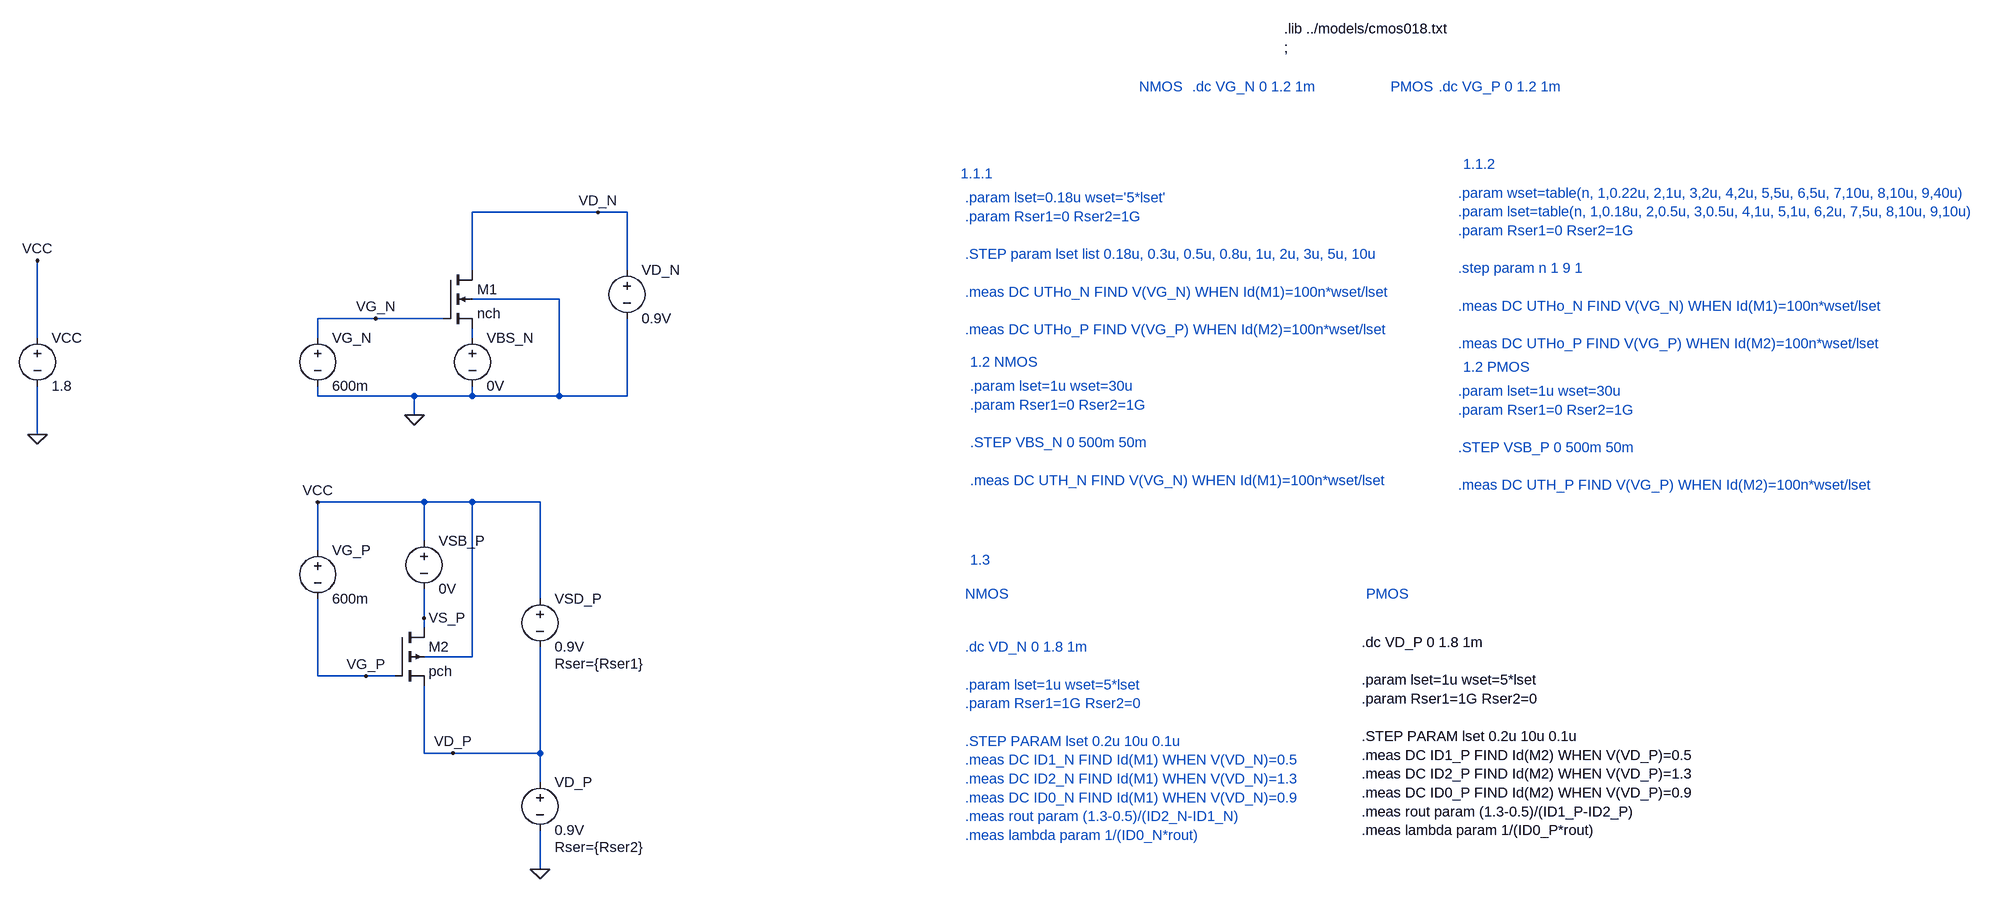
[diagram p0: schematic 1.asc]
1.asc, the LTspice schematic file:
Version 4
SHEET 1 2972 996
WIRE 464 -112 256 -112
WIRE 512 -112 464 -112
WIRE 256 -16 256 -112
WIRE 512 -16 512 -112
WIRE 400 32 256 32
WIRE 96 64 0 64
WIRE 208 64 96 64
WIRE -464 96 -464 -32
WIRE 0 96 0 64
WIRE 256 96 256 80
WIRE 0 192 0 176
WIRE 160 192 0 192
WIRE 256 192 256 176
WIRE 256 192 160 192
WIRE 400 192 400 32
WIRE 400 192 256 192
WIRE 512 192 512 64
WIRE 512 192 400 192
WIRE 160 224 160 192
WIRE -464 256 -464 176
WIRE 176 368 0 368
WIRE 256 368 176 368
WIRE 368 368 256 368
WIRE 176 432 176 368
WIRE 0 448 0 368
WIRE 368 528 368 368
WIRE 176 560 176 512
WIRE 176 576 176 560
WIRE 256 624 256 368
WIRE 256 624 176 624
WIRE 0 656 0 528
WIRE 80 656 0 656
WIRE 128 656 80 656
WIRE 176 784 176 672
WIRE 224 784 176 784
WIRE 368 784 368 608
WIRE 368 784 224 784
WIRE 368 832 368 784
WIRE 368 976 368 912
FLAG 160 224 0
FLAG 96 64 VG_N
FLAG 80 656 VG_P
FLAG 464 -112 VD_N
FLAG -464 256 0
FLAG -464 -32 VCC
FLAG 0 368 VCC
FLAG 368 976 0
FLAG 224 784 VD_P
FLAG 176 560 VS_P
SYMBOL voltage 0 80 R0
SYMATTR InstName VG_N
SYMATTR Value 600m
SYMBOL nmos4 208 -16 R0
SYMATTR InstName M1
SYMATTR Value nch
SYMATTR Value2 l=lset w=wset
SYMBOL voltage 512 -32 R0
SYMATTR InstName VD_N
SYMATTR Value 0.9V
SYMBOL voltage 0 432 R0
SYMATTR InstName VG_P
SYMATTR Value 600m
SYMBOL voltage 368 512 R0
WINDOW 123 0 0 Left 0
WINDOW 39 24 124 Left 2
SYMATTR SpiceLine Rser={Rser1}
SYMATTR InstName VSD_P
SYMATTR Value 0.9V
SYMBOL pmos4 128 576 R0
SYMATTR InstName M2
SYMATTR Value pch
SYMATTR Value2 l=lset w=wset
SYMBOL voltage 256 80 R0
SYMATTR InstName VBS_N
SYMATTR Value 0V
SYMBOL voltage 176 416 R0
SYMATTR InstName VSB_P
SYMATTR Value 0V
SYMBOL voltage -464 80 R0
SYMATTR InstName VCC
SYMATTR Value 1.8
SYMBOL voltage 368 816 R0
WINDOW 123 0 0 Left 0
WINDOW 39 24 124 Left 2
SYMATTR SpiceLine Rser={Rser2}
SYMATTR InstName VD_P
SYMATTR Value 0.9V
TEXT 1600 -416 Left 2 !.lib ../models/cmos018.txt\n; \n
TEXT 1888 -144 Left 2 ;.param wset=table(n, 1,0.22u, 2,1u, 3,2u, 4,2u, 5,5u, 6,5u, 7,10u, 8,10u, 9,40u) \n.param lset=table(n, 1,0.18u, 2,0.5u, 3,0.5u, 4,1u, 5,1u, 6,2u, 7,5u, 8,10u, 9,10u)\n.param Rser1=0 Rser2=1G\n \n.step param n 1 9 1\n \n.meas DC UTHo_N FIND V(VG_N) WHEN Id(M1)=100n*wset/lset\n \n.meas DC UTHo_P FIND V(VG_P) WHEN Id(M2)=100n*wset/lset
TEXT 1072 -136 Left 2 ;.param lset=0.18u wset='5*lset'\n.param Rser1=0 Rser2=1G\n \n.STEP param lset list 0.18u, 0.3u, 0.5u, 0.8u, 1u, 2u, 3u, 5u, 10u\n \n.meas DC UTHo_N FIND V(VG_N) WHEN Id(M1)=100n*wset/lset\n \n.meas DC UTHo_P FIND V(VG_P) WHEN Id(M2)=100n*wset/lset
TEXT 1064 -176 Left 2 ;1.1.1
TEXT 1896 -192 Left 2 ;1.1.2
TEXT 1856 -320 Left 2 ;.dc VG_P 0 1.2 1m
TEXT 1360 -320 Left 2 ;NMOS
TEXT 1776 -320 Left 2 ;PMOS
TEXT 1448 -320 Left 2 ;.dc VG_N 0 1.2 1m
TEXT 1080 136 Left 2 ;1.2 NMOS
TEXT 1080 176 Left 2 ;.param lset=1u wset=30u\n.param Rser1=0 Rser2=1G\n \n.STEP VBS_N 0 500m 50m\n \n.meas DC UTH_N FIND V(VG_N) WHEN Id(M1)=100n*wset/lset
TEXT 1080 464 Left 2 ;1.3
TEXT 1072 608 Left 2 ;.dc VD_N 0 1.8 1m\n \n.param lset=1u wset=5*lset\n.param Rser1=1G Rser2=0\n \n.STEP PARAM lset 0.2u 10u 0.1u\n.meas DC ID1_N FIND Id(M1) WHEN V(VD_N)=0.5\n.meas DC ID2_N FIND Id(M1) WHEN V(VD_N)=1.3\n.meas DC ID0_N FIND Id(M1) WHEN V(VD_N)=0.9\n.meas rout param (1.3-0.5)/(ID2_N-ID1_N)\n.meas lambda param 1/(ID0_N*rout)
TEXT 1072 520 Left 2 ;NMOS
TEXT 1736 520 Left 2 ;PMOS
TEXT 1728 600 Left 2 !.dc VD_P 0 1.8 1m\n \n.param lset=1u wset=5*lset\n.param Rser1=1G Rser2=0\n \n.STEP PARAM lset 0.2u 10u 0.1u\n.meas DC ID1_P FIND Id(M2) WHEN V(VD_P)=0.5\n.meas DC ID2_P FIND Id(M2) WHEN V(VD_P)=1.3\n.meas DC ID0_P FIND Id(M2) WHEN V(VD_P)=0.9\n.meas rout param (1.3-0.5)/(ID1_P-ID2_P)\n.meas lambda param 1/(ID0_P*rout)
TEXT 1888 184 Left 2 ;.param lset=1u wset=30u\n.param Rser1=0 Rser2=1G\n \n.STEP VSB_P 0 500m 50m\n \n.meas DC UTH_P FIND V(VG_P) WHEN Id(M2)=100n*wset/lset
TEXT 1896 144 Left 2 ;1.2 PMOS

The netlist it stands for:
* 1.asc
VG_N VG_N 0 600m
M1 VD_N VG_N N001 0 nch l=lset w=wset
VD_N VD_N 0 0.9V
VG_P VCC VG_P 600m
VSD_P VCC VD_P 0.9V Rser={Rser1}
M2 VS_P VG_P VD_P VCC pch l=lset w=wset
VBS_N N001 0 0V
VSB_P VCC VS_P 0V
VCC VCC 0 1.8
VD_P VD_P 0 0.9V Rser={Rser2}
.model NMOS NMOS
.model PMOS PMOS
.lib standard.mos
.lib ../models/cmos018.txt
;
* .param wset=table(n, 1,0.22u, 2,1u, 3,2u, 4,2u, 5,5u, 6,5u, 7,10u, 8,10u, 9,40u)
* .param lset=table(n, 1,0.18u, 2,0.5u, 3,0.5u, 4,1u, 5,1u, 6,2u, 7,5u, 8,10u, 9,10u)
* .param Rser1=0 Rser2=1G
* .step param n 1 9 1
* .meas DC UTHo_N FIND V(VG_N) WHEN Id(M1)=100n*wset/lset
* .meas DC UTHo_P FIND V(VG_P) WHEN Id(M2)=100n*wset/lset
* .param lset=0.18u wset='5*lset'
* .param Rser1=0 Rser2=1G
* .STEP param lset list 0.18u, 0.3u, 0.5u, 0.8u, 1u, 2u, 3u, 5u, 10u
* .meas DC UTHo_N FIND V(VG_N) WHEN Id(M1)=100n*wset/lset
* .meas DC UTHo_P FIND V(VG_P) WHEN Id(M2)=100n*wset/lset
* 1.1.1
* 1.1.2
* .dc VG_P 0 1.2 1m
* NMOS
* PMOS
* .dc VG_N 0 1.2 1m
* 1.2 NMOS
* .param lset=1u wset=30u
* .param Rser1=0 Rser2=1G
* .STEP VBS_N 0 500m 50m
* .meas DC UTH_N FIND V(VG_N) WHEN Id(M1)=100n*wset/lset
* 1.3
* .dc VD_N 0 1.8 1m
* .param lset=1u wset=5*lset
* .param Rser1=1G Rser2=0
* .STEP PARAM lset 0.2u 10u 0.1u
* .meas DC ID1_N FIND Id(M1) WHEN V(VD_N)=0.5
* .meas DC ID2_N FIND Id(M1) WHEN V(VD_N)=1.3
* .meas DC ID0_N FIND Id(M1) WHEN V(VD_N)=0.9
* .meas rout param (1.3-0.5)/(ID2_N-ID1_N)
* .meas lambda param 1/(ID0_N*rout)
* NMOS
* PMOS
.dc VD_P 0 1.8 1m
.param lset=1u wset=5*lset
.param Rser1=1G Rser2=0
.STEP PARAM lset 0.2u 10u 0.1u
.meas DC ID1_P FIND Id(M2) WHEN V(VD_P)=0.5
.meas DC ID2_P FIND Id(M2) WHEN V(VD_P)=1.3
.meas DC ID0_P FIND Id(M2) WHEN V(VD_P)=0.9
.meas rout param (1.3-0.5)/(ID1_P-ID2_P)
.meas lambda param 1/(ID0_P*rout)
* .param lset=1u wset=30u
* .param Rser1=0 Rser2=1G
* .STEP VSB_P 0 500m 50m
* .meas DC UTH_P FIND V(VG_P) WHEN Id(M2)=100n*wset/lset
* 1.2 PMOS
.backanno
.end